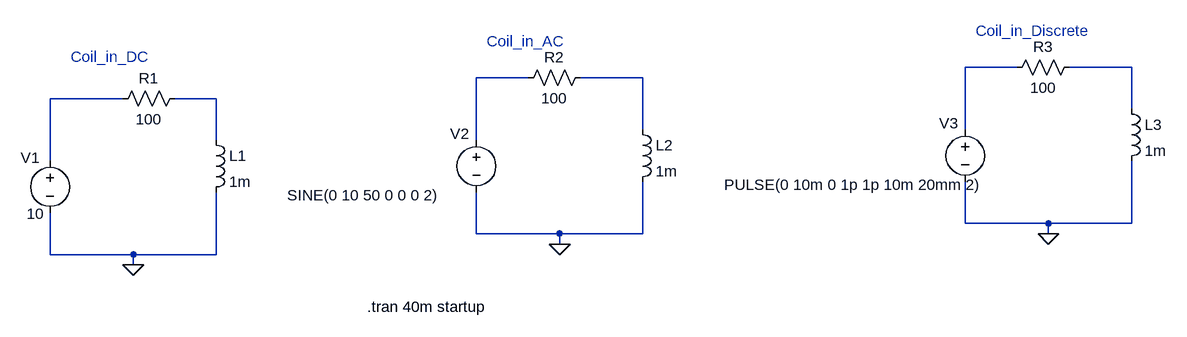
[diagram p0: schematic Coil.asc]
Coil.asc, the LTspice schematic file:
Version 4
SHEET 1 1420 680
WIRE 1184 16 1104 16
WIRE 1360 16 1264 16
WIRE 432 32 352 32
WIRE 608 32 512 32
WIRE -192 64 -304 64
WIRE -48 64 -112 64
WIRE 1360 80 1360 16
WIRE 608 112 608 32
WIRE 1104 112 1104 16
WIRE -48 128 -48 64
WIRE 352 128 352 32
WIRE -304 160 -304 64
WIRE 1104 256 1104 192
WIRE 1232 256 1104 256
WIRE 1360 256 1360 160
WIRE 1360 256 1232 256
WIRE 352 272 352 208
WIRE 480 272 352 272
WIRE 608 272 608 192
WIRE 608 272 480 272
WIRE 1232 272 1232 256
WIRE 480 288 480 272
WIRE -304 304 -304 240
WIRE -176 304 -304 304
WIRE -48 304 -48 208
WIRE -48 304 -176 304
WIRE -176 320 -176 304
FLAG 480 288 0
FLAG -176 320 0
FLAG 1232 272 0
SYMBOL res 416 48 R270
WINDOW 0 32 56 VTop 2
WINDOW 3 0 56 VBottom 2
SYMATTR InstName R2
SYMATTR Value 100
SYMBOL voltage 352 112 R0
WINDOW 3 -291 101 Left 2
WINDOW 123 -76 97 Left 2
WINDOW 39 0 0 Left 0
WINDOW 0 -40 6 Left 2
SYMATTR Value SINE(0 10 50 0 0 0 2)
SYMATTR InstName V2
SYMBOL res -208 80 R270
WINDOW 0 32 56 VTop 2
WINDOW 3 0 56 VBottom 2
SYMATTR InstName R1
SYMATTR Value 100
SYMBOL voltage -304 144 R0
WINDOW 0 -45 11 Left 2
WINDOW 3 -36 97 Left 2
WINDOW 123 -76 97 Left 2
WINDOW 39 0 0 Left 0
SYMATTR InstName V1
SYMATTR Value 10
SYMBOL res 1168 32 R270
WINDOW 0 32 56 VTop 2
WINDOW 3 0 56 VBottom 2
SYMATTR InstName R3
SYMATTR Value 100
SYMBOL voltage 1104 96 R0
WINDOW 3 -371 101 Left 2
WINDOW 123 -76 97 Left 2
WINDOW 39 0 0 Left 0
WINDOW 0 -40 6 Left 2
SYMATTR Value PULSE(0 10m 0 1p 1p 10m 20mm 2)
SYMATTR InstName V3
SYMBOL ind -64 112 R0
SYMATTR InstName L1
SYMATTR Value 1m
SYMBOL ind 592 96 R0
SYMATTR InstName L2
SYMATTR Value 1m
SYMBOL ind 1344 64 R0
SYMATTR InstName L3
SYMATTR Value 1m
TEXT 184 384 Left 2 !.tran 40m startup
TEXT -272 0 Left 2 ;Coil_in_DC
TEXT 368 -24 Left 2 ;Coil_in_AC
TEXT 1120 -40 Left 2 ;Coil_in_Discrete

The netlist it stands for:
* Coil.asc
R2 N003 N004 100
V2 N003 0 SINE(0 10 50 0 0 0 2)
R1 N005 N006 100
V1 N005 0 10
R3 N001 N002 100
V3 N001 0 PULSE(0 10m 0 1p 1p 10m 20mm 2)
L1 N006 0 1m
L2 N004 0 1m
L3 N002 0 1m
.tran 40m startup
* Coil_in_DC
* Coil_in_AC
* Coil_in_Discrete
.backanno
.end